# EAGLE design headstage (EAGLE 7.2.0)
HEADSTAGE_TYPE: JMD Dual RHD2132; REVISION: 0.0
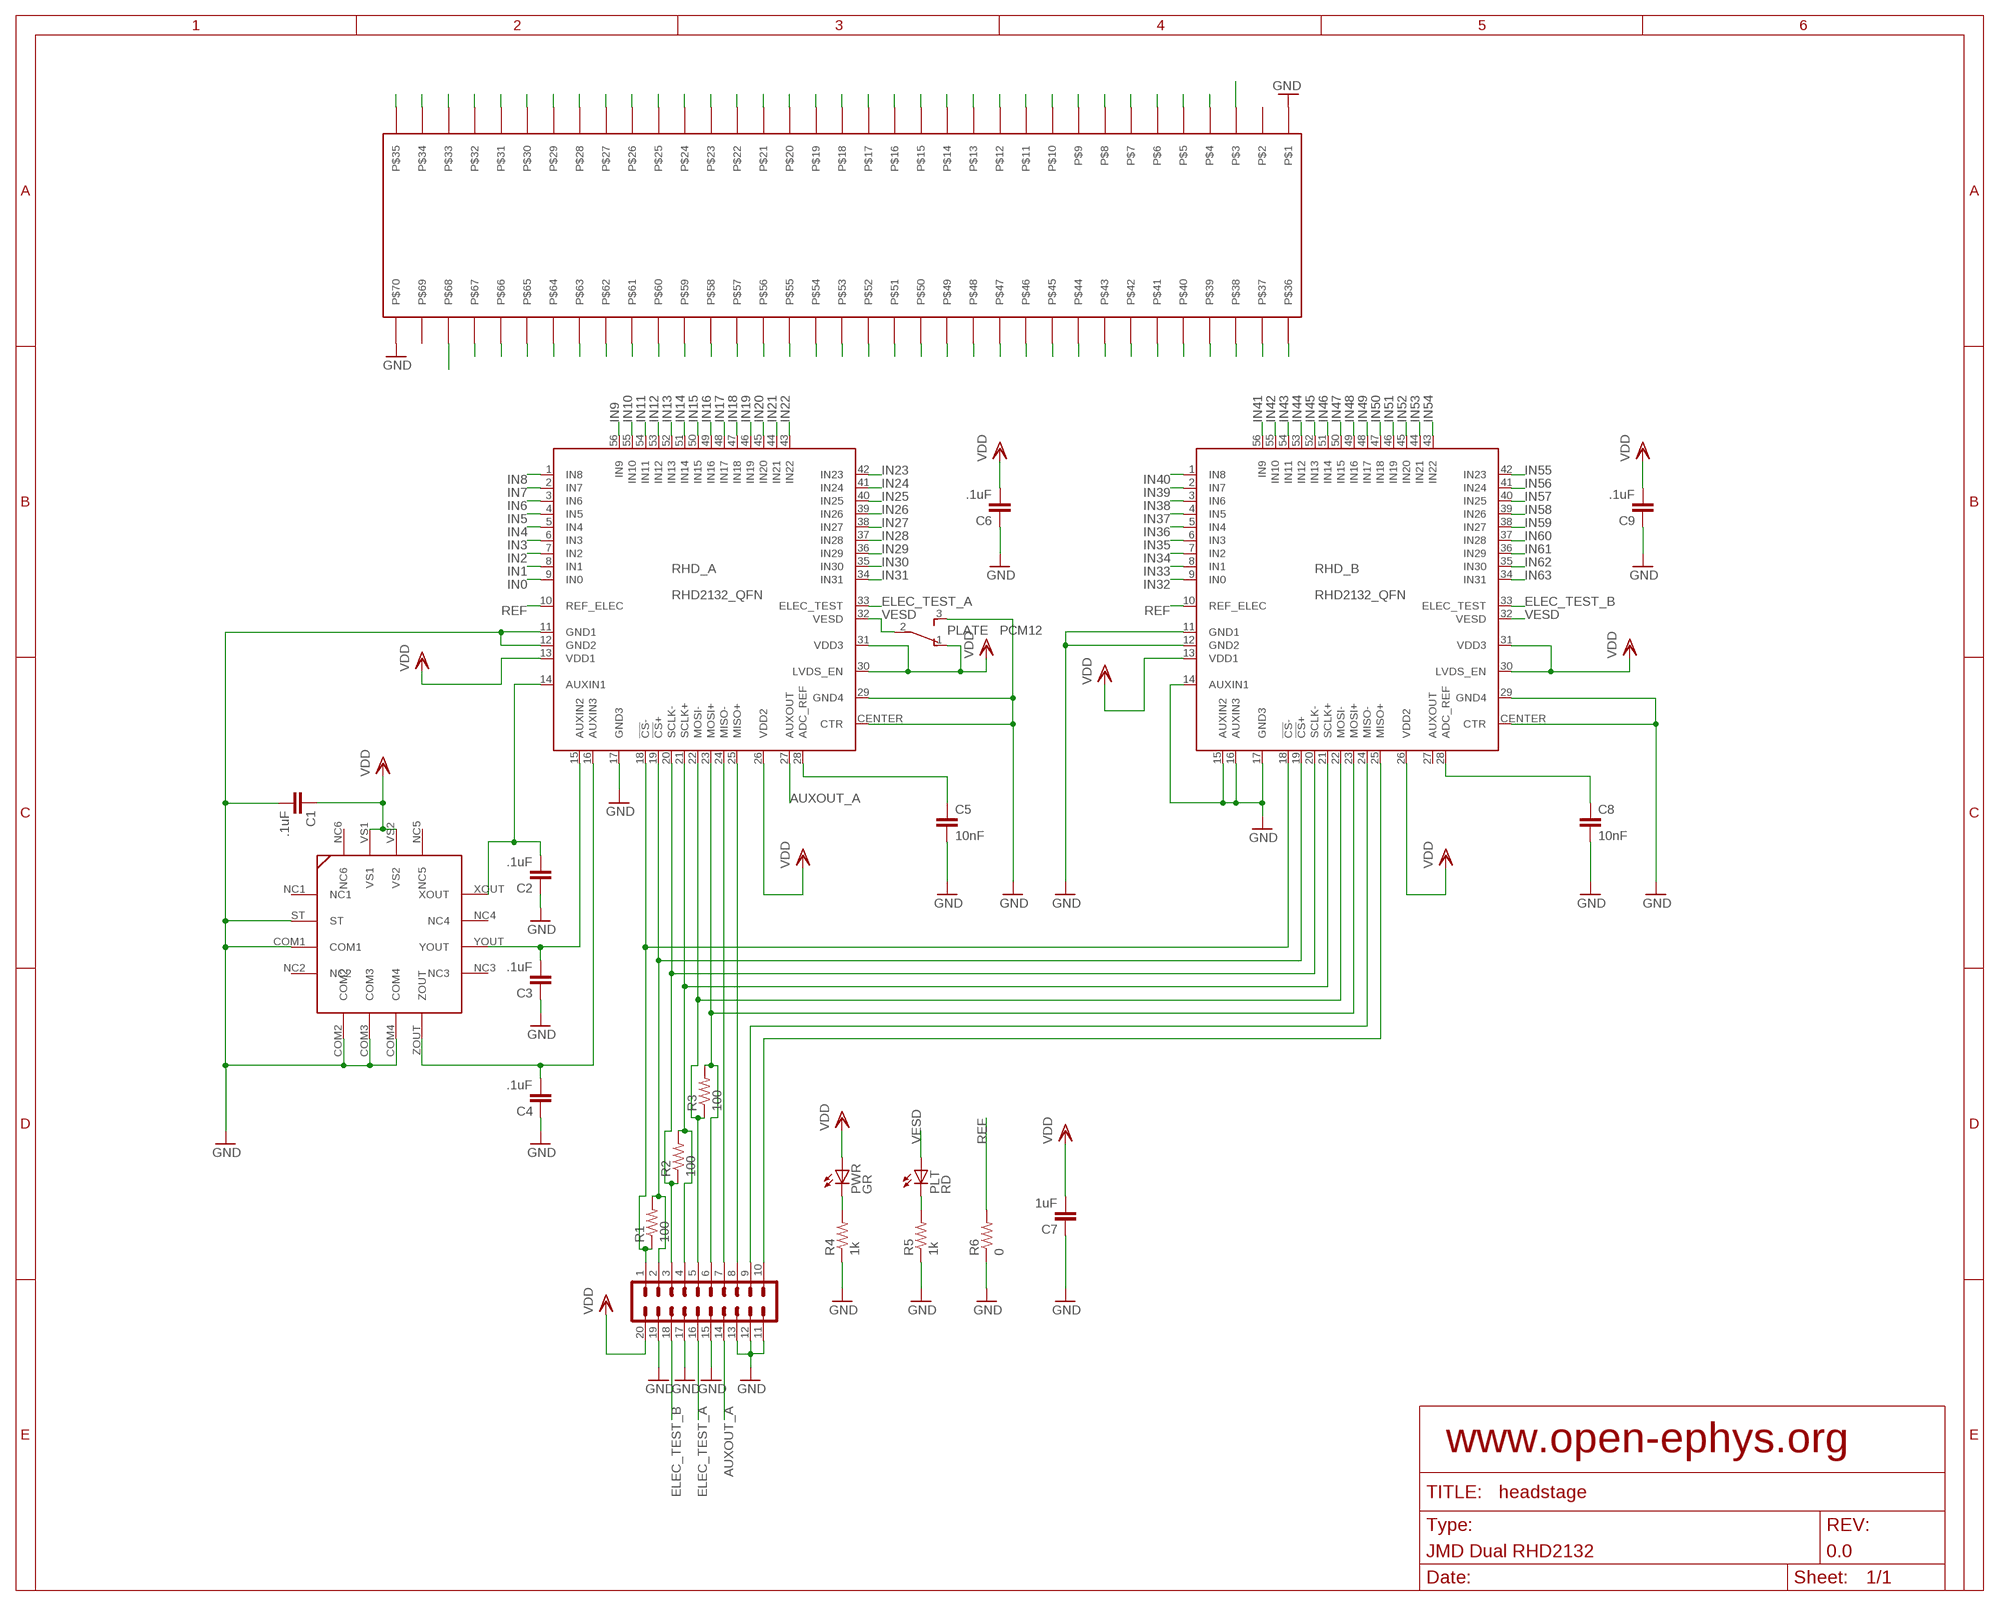
[diagram p0: schematic, sheet 1]

## Parts
C1  .1uF  C_0402  [0402]
C2  .1uF  C_0402  [0402]
C3  .1uF  C_0402  [0402]
C4  .1uF  C_0402  [0402]
C5  10nF  C_0402  [0402]
C6  .1uF  C_0603  [0603]
C7  1uF  C_0603  [0603]
C8  10nF  C_0402  [0402]
C9  .1uF  C_0603  [0603]
OUT  JMD  PINHD-2X10_JMD-RA  [JMD20-RA]
PLATE  PCM12  SPDT_PCM12  [PCM12]
PLT  RD  LED_0603  [CHIP-LED0603]
PWR  GR  LED_0603  [CHIP-LED0603]
R1  100  R_0402  [0402]
R2  100  R_0402  [0402]
R3  100  R_0402  [0402]
R4  1k  R_0402  [0402]
R5  1k  R_0402  [0402]
R6  0  R_0402  [0402]
RHD_A  RHD2132_QFN  [QFN56_8_X_8_LARGE]
RHD_B  RHD2132_QFN  [QFN56_8_X_8_LARGE]
U1  ADXL335  [ADXL335]
U$1  HIROSE_DF40_70PIN  [HIROSE_DF40C-70DS]

## Nets
AUXOUT_A: OUT.14 RHD_A.27(AUXOUT)
CS+: OUT.2 R1.2 RHD_A.19(!CS!+) RHD_B.19(!CS!+)
CS-: OUT.1 R1.1 RHD_A.18(!CS!-) RHD_B.18(!CS!-)
ELEC_TEST_A: OUT.16 RHD_A.33(ELEC_TEST)
ELEC_TEST_B: OUT.18 RHD_B.33(ELEC_TEST)
GND: C1.2 C2.1 C3.1 C4.1 C5.2 C6.1 C7.1 C8.2 C9.1 OUT.11 OUT.12 OUT.13 OUT.15 OUT.17 OUT.19 PLATE.3 R4.1 R5.1 R6.1 RHD_A.11(GND1) RHD_A.12(GND2) RHD_A.17(GND3) RHD_A.29(GND4) RHD_A.CENTER(CTR) RHD_B.11(GND1) RHD_B.12(GND2) RHD_B.14(AUXIN1) RHD_B.15(AUXIN2) RHD_B.16(AUXIN3) RHD_B.17(GND3) RHD_B.29(GND4) RHD_B.CENTER(CTR) U1.COM1 U1.COM2 U1.COM3 U1.COM4 U1.ST U$1.P$1 U$1.P$70
IN0: RHD_A.9(IN0) U$1.P$4
IN1: RHD_A.8(IN1) U$1.P$5
IN2: RHD_A.7(IN2) U$1.P$6
IN3: RHD_A.6(IN3) U$1.P$7
IN4: RHD_A.5(IN4) U$1.P$8
IN5: RHD_A.4(IN5) U$1.P$9
IN6: RHD_A.3(IN6) U$1.P$10
IN7: RHD_A.2(IN7) U$1.P$11
IN8: RHD_A.1(IN8) U$1.P$12
IN9: RHD_A.56(IN9) U$1.P$13
IN10: RHD_A.55(IN10) U$1.P$14
IN11: RHD_A.54(IN11) U$1.P$15
IN12: RHD_A.53(IN12) U$1.P$16
IN13: RHD_A.52(IN13) U$1.P$17
IN14: RHD_A.51(IN14) U$1.P$18
IN15: RHD_A.50(IN15) U$1.P$19
IN16: RHD_A.49(IN16) U$1.P$20
IN17: RHD_A.48(IN17) U$1.P$21
IN18: RHD_A.47(IN18) U$1.P$22
IN19: RHD_A.46(IN19) U$1.P$23
IN20: RHD_A.45(IN20) U$1.P$24
IN21: RHD_A.44(IN21) U$1.P$25
IN22: RHD_A.43(IN22) U$1.P$26
IN23: RHD_A.42(IN23) U$1.P$27
IN24: RHD_A.41(IN24) U$1.P$28
IN25: RHD_A.40(IN25) U$1.P$29
IN26: RHD_A.39(IN26) U$1.P$30
IN27: RHD_A.38(IN27) U$1.P$31
IN28: RHD_A.37(IN28) U$1.P$32
IN29: RHD_A.36(IN29) U$1.P$33
IN30: RHD_A.35(IN30) U$1.P$34
IN31: RHD_A.34(IN31) U$1.P$35
IN32: RHD_B.9(IN0) U$1.P$67
IN33: RHD_B.8(IN1) U$1.P$66
IN34: RHD_B.7(IN2) U$1.P$65
IN35: RHD_B.6(IN3) U$1.P$64
IN36: RHD_B.5(IN4) U$1.P$63
IN37: RHD_B.4(IN5) U$1.P$62
IN38: RHD_B.3(IN6) U$1.P$61
IN39: RHD_B.2(IN7) U$1.P$60
IN40: RHD_B.1(IN8) U$1.P$59
IN41: RHD_B.56(IN9) U$1.P$58
IN42: RHD_B.55(IN10) U$1.P$57
IN43: RHD_B.54(IN11) U$1.P$56
IN44: RHD_B.53(IN12) U$1.P$55
IN45: RHD_B.52(IN13) U$1.P$54
IN46: RHD_B.51(IN14) U$1.P$53
IN47: RHD_B.50(IN15) U$1.P$52
IN48: RHD_B.49(IN16) U$1.P$51
IN49: RHD_B.48(IN17) U$1.P$50
IN50: RHD_B.47(IN18) U$1.P$49
IN51: RHD_B.46(IN19) U$1.P$48
IN52: RHD_B.45(IN20) U$1.P$47
IN53: RHD_B.44(IN21) U$1.P$46
IN54: RHD_B.43(IN22) U$1.P$45
IN55: RHD_B.42(IN23) U$1.P$44
IN56: RHD_B.41(IN24) U$1.P$43
IN57: RHD_B.40(IN25) U$1.P$42
IN58: RHD_B.39(IN26) U$1.P$41
IN59: RHD_B.38(IN27) U$1.P$40
IN60: RHD_B.37(IN28) U$1.P$39
IN61: RHD_B.36(IN29) U$1.P$38
IN62: RHD_B.35(IN30) U$1.P$37
IN63: RHD_B.34(IN31) U$1.P$36
LEDOUT1: PWR.C R4.2
LEDOUT2: PLT.C R5.2
MIS02-: OUT.9 RHD_B.24(MISO-)
MISO1+: OUT.8 RHD_A.25(MISO+)
MISO1-: OUT.7 RHD_A.24(MISO-)
MISO2+: OUT.10 RHD_B.25(MISO+)
MOSI+: OUT.6 R3.2 RHD_A.23(MOSI+) RHD_B.23(MOSI+)
MOSI-: OUT.5 R3.1 RHD_A.22(MOSI-) RHD_B.22(MOSI-)
N$3: C8.1 RHD_B.28(ADC_REF)
N$7: C5.1 RHD_A.28(ADC_REF)
REF: R6.2 RHD_A.10(REF_ELEC) RHD_B.10(REF_ELEC) U$1.P$3 U$1.P$68
SCLK+: OUT.4 R2.2 RHD_A.21(SCLK+) RHD_B.21(SCLK+)
SCLK-: OUT.3 R2.1 RHD_A.20(SCLK-) RHD_B.20(SCLK-)
VDD: C1.1 C6.2 C7.2 C9.2 OUT.20 PLATE.1 PWR.A RHD_A.13(VDD1) RHD_A.26(VDD2) RHD_A.30(LVDS_EN) RHD_A.31(VDD3) RHD_B.13(VDD1) RHD_B.26(VDD2) RHD_B.30(LVDS_EN) RHD_B.31(VDD3) U1.VS1 U1.VS2
VESD: PLATE.2 PLT.A RHD_A.32(VESD) RHD_B.32(VESD)
XOUT1: C2.2 RHD_A.14(AUXIN1) U1.XOUT
YOUT1: C3.2 RHD_A.15(AUXIN2) U1.YOUT
ZOUT1: C4.2 RHD_A.16(AUXIN3) U1.ZOUT
Unconnected: RHD_B.27(AUXOUT) U1.NC1 U1.NC2 U1.NC3 U1.NC4 U1.NC5 U1.NC6 U$1.P$2 U$1.P$69

## Library data of the parts
C1-C9 = headstage:C: Capacitor
OUT = headstage:PINHD-2X10
PLATE = headstage:SPDT: SPDT Switch
PLT PWR = puggleboard:LED
R1-R6 = headstage:R: Resistor
RHD_A RHD_B = headstage:RHD2132
U1 = headstage:ADXL335: The ADXL335 is a small, thin, low power, complete 3-axis accelerometer with signal conditioned voltage outputs. The product measures acceleration with a minimum full-scale range of ±3 g. It can measure the static acceleration of gravity in tilt-sensing applications, as well as dynamic acceleration resulting from motion, shock, or vibration. The user selects the bandwidth of the accelerometer using the CX, CY, and CZ capacitors at the XOUT, YOUT, and ZOUT pins. Bandwidths can be selected to suit the application, with a range of 0.5 Hz to 1600 Hz for the X and Y axes, and a range of 0.5 Hz to 550 Hz for the Z axi
U$1 = GG_hirose70:HIROSE_DF40_70PIN

## Board
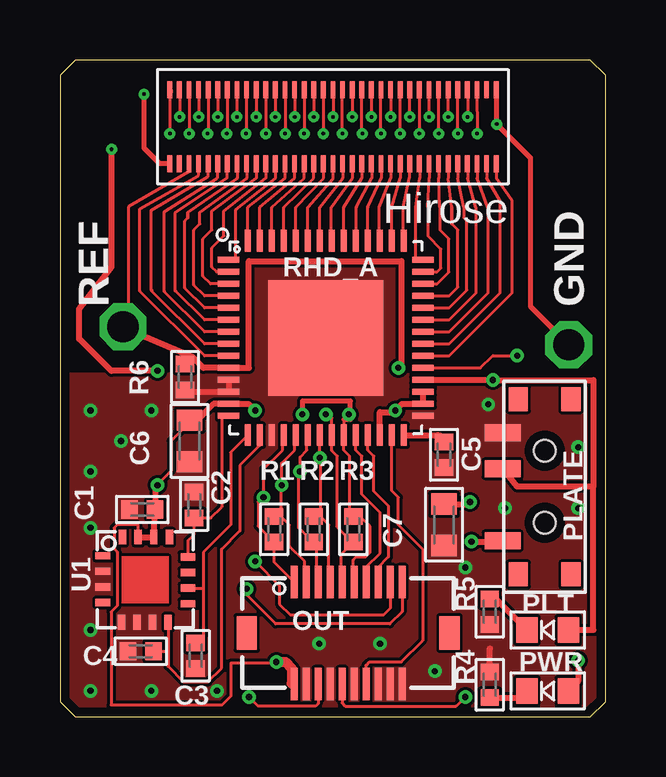
[diagram p1: board, top side]
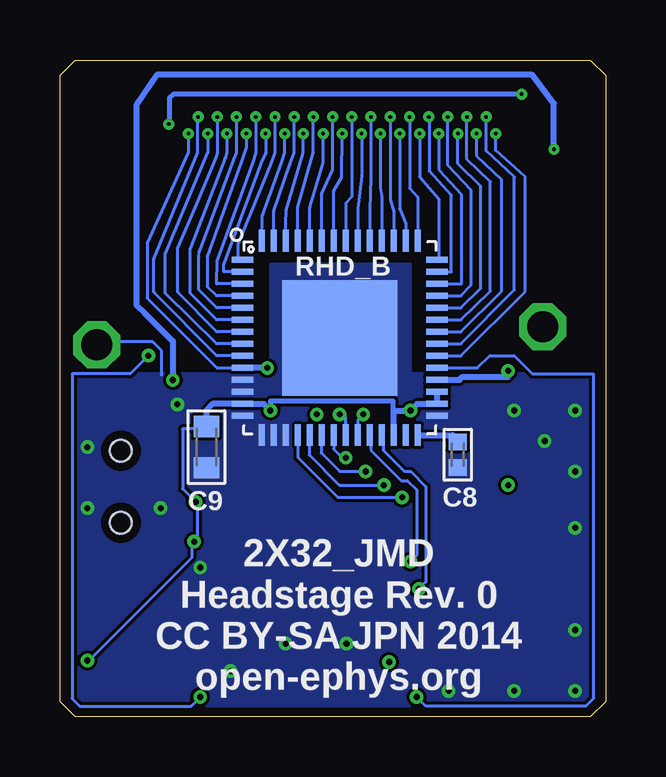
[diagram p2: board, bottom side, seen from below]

Size 22.73 x 27.37 mm. Coordinates in mm from the lower left corner, seen from the top.
Outline: 0.64,0 22.1,0 22.73,0.64 22.73,26.73 22.1,27.37 0.64,27.37 0,26.73 0,0.64 0.64,0
Copper layers (1+2*15+16): Top 0.0356mm / dielectric 1.5011mm / Route2 0.0356mm / dielectric 0.1499mm / Route15 0.0356mm / dielectric 0.2007mm / Bottom 0.0356mm
Design rules "ohs-park-4-layer *": minimum track width 5mil, minimum drill 10mil, track to track 5mil, track to pad 5mil, pad to pad 5mil, via to via 5mil, smd to smd 5mil, copper to edge 15mil, drill to drill 5mil, minimum pad ring 6mil, minimum via ring 6mil, stop-mask expansion 4mil, vias tented up to drill 100mil, thermal gap 10mil

### Footprints (pad centres in the part's own frame; a part is rotated, then mirrored left to right if it is on the bottom)
0402 = smd 0.686 x 0.762: 1 -0.533,0; 2 0.533,0
0603 = smd 0.889 x 1.067: 1 -0.864,0; 2 0.864,0
JMD20-RA = smd 0.3 x 1.35: 1 -4.5,2.125; 2 -4,2.125; 3 -3.5,2.125; 4 -3,2.125; 5 -2.5,2.125; 6 -2,2.125; 7 -1.5,2.125; 8 -1,2.125; 9 -0.5,2.125; 10 0,2.125; 11 0,-2.125; 12 -0.5,-2.125; 13 -1,-2.125; 14 -1.5,-2.125; 15 -2,-2.125; 16 -2.5,-2.125; 17 -3,-2.125; 18 -3.5,-2.125; 19 -4,-2.125; 20 -4.5,-2.125 | smd 0.85 x 1.4: MECH1 -6.475,0; MECH2 1.975,0
PCM12 = smd 0.7 x 1.5: 1 -2.25,1.75; 2 0.75,1.75; 3 2.25,1.75 | smd 1 x 0.8: NC1 -3.65,1.1; NC2 -3.65,-1.1; NC3 3.65,-1.1; NC4 3.65,1.1 | hole 0.9: 1.5,0; -1.5,0
CHIP-LED0603 = smd 1.067 x 0.889: A 0,-0.864; C 0,0.864
QFN56_8_X_8_LARGE = smd 0.9 x 0.25: 1 -4.05,3.25; 2 -4.05,2.75; 3 -4.05,2.25; 4 -4.05,1.75; 5 -4.05,1.25; 6 -4.05,0.75; 7 -4.05,0.25; 8 -4.05,-0.25; 9 -4.05,-0.75; 10 -4.05,-1.25; 11 -4.05,-1.75; 12 -4.05,-2.25; 13 -4.05,-2.75; 14 -4.05,-3.25; 29 4.05,-3.25; 30 4.05,-2.75; 31 4.05,-2.25; 32 4.05,-1.75; 33 4.05,-1.25; 34 4.05,-0.75; 35 4.05,-0.25; 36 4.05,0.25; 37 4.05,0.75; 38 4.05,1.25; 39 4.05,1.75; 40 4.05,2.25; 41 4.05,2.75; 42 4.05,3.25 | smd 0.25 x 0.9: 15 -3.25,-4.05; 16 -2.75,-4.05; 17 -2.25,-4.05; 18 -1.75,-4.05; 19 -1.25,-4.05; 20 -0.75,-4.05; 21 -0.25,-4.05; 22 0.25,-4.05; 23 0.75,-4.05; 24 1.25,-4.05; 25 1.75,-4.05; 26 2.25,-4.05; 27 2.75,-4.05; 28 3.25,-4.05; 43 3.25,4.05; 44 2.75,4.05; 45 2.25,4.05; 46 1.75,4.05; 47 1.25,4.05; 48 0.75,4.05; 49 0.25,4.05; 50 -0.25,4.05; 51 -0.75,4.05; 52 -1.25,4.05; 53 -1.75,4.05; 54 -2.25,4.05; 55 -2.75,4.05; 56 -3.25,4.05 | smd 4.8 x 4.8: CENTER 0,0
ADXL335 = smd 0.61 x 0.305: COM1 -1.775,-0.3; NC1 -1.775,1; NC2 -1.775,-0.95; NC3 1.775,-1; NC4 1.775,0.3; ST -1.775,0.35; XOUT 1.775,0.95; YOUT 1.775,-0.35 | smd 0.305 x 0.61: COM2 -1,-1.775; COM3 -0.35,-1.775; COM4 0.3,-1.775; NC5 1,1.775; NC6 -0.95,1.775; VS1 0.35,1.775; VS2 -0.3,1.775; ZOUT 0.95,-1.775
HIROSE_DF40C-70DS = smd 0.2 x 0.7: P$1 0,0; P$2 -0.4,0; P$3 -0.8,0; P$4 -1.2,0; P$5 -1.6,0; P$6 -2,0; P$7 -2.4,0; P$8 -2.8,0; P$9 -3.2,0; P$10 -3.6,0; P$11 -4,0; P$12 -4.4,0; P$13 -4.8,0; P$14 -5.2,0; P$15 -5.6,0; P$16 -6,0; P$17 -6.4,0; P$18 -6.8,0; P$19 -7.2,0; P$20 -7.6,0; P$21 -8,0; P$22 -8.4,0; P$23 -8.8,0; P$24 -9.2,0; P$25 -9.6,0; P$26 -10,0; P$27 -10.4,0; P$28 -10.8,0; P$29 -11.2,0; P$30 -11.6,0; P$31 -12,0; P$32 -12.4,0; P$33 -12.8,0; P$34 -13.2,0; P$35 -13.6,0; P$36 0,-3.08; P$37 -0.4,-3.08; P$38 -0.8,-3.08; P$39 -1.2,-3.08; P$40 -1.6,-3.08; P$41 -2,-3.08; P$42 -2.4,-3.08; P$43 -2.8,-3.08; P$44 -3.2,-3.08; P$45 -3.6,-3.08; P$46 -4,-3.08; P$47 -4.4,-3.08; P$48 -4.8,-3.08; P$49 -5.2,-3.08; P$50 -5.6,-3.08; P$51 -6,-3.08; P$52 -6.4,-3.08; P$53 -6.8,-3.08; P$54 -7.2,-3.08; P$55 -7.6,-3.08; P$56 -8,-3.08; P$57 -8.4,-3.08; P$58 -8.8,-3.08; P$59 -9.2,-3.08; P$60 -9.6,-3.08; P$61 -10,-3.08; P$62 -10.4,-3.08; P$63 -10.8,-3.08; P$64 -11.2,-3.08; P$65 -11.6,-3.08; P$66 -12,-3.08; P$67 -12.4,-3.08; P$68 -12.8,-3.08; P$69 -13.2,-3.08; P$70 -13.6,-3.08

### Placement (x,y rotation side)
C1  3.43,8.64 180 top
C2  5.59,8.83 270 top
C3  5.65,2.54 90 top
C4  3.37,2.73 0 top
C5  16,10.92 270 top
C6  5.4,11.49 90 top
C7  16,8 90 top
C8  6.16,10.92 270 bottom
C9  16.64,11.24 90 bottom
OUT  14.26,3.49 0 top
PLATE  20.19,9.59 90 top
PLT  20.32,3.62 90 top
PWR  20.32,1.08 90 top
R1  8.92,7.81 90 top
R2  10.57,7.81 90 top
R3  12.22,7.81 90 top
R4  17.91,1.33 270 top
R5  17.91,4.38 90 top
R6  5.21,14.16 90 top
RHD_A  11.07,15.79 0 top
RHD_B  11.07,15.79 0 bottom
U1  3.56,5.71 0 top
U$1  4.57,23.05 180 top

### Tracks (layer width: path | path; a pad name or v marks a point on that pad's centre or on a via)
AUXOUT_A
  Top 0.127: RHD_A.27 13.82,9.42 14.1,9.14 14.1,8 15.11,6.99 15.11,3.17 14.22,2.29 12.89,2.29 12.76,2.15 OUT.14
  Top 0.152: RHD_A.27 13.84,11.72
CS+  (via drill 0.25)
  Top 0.127: 10.19,5.55 10.19,6.48 9.56,7.11 9.56,8 9.21,8.34 9.21,9.63 v9.24,9.65 9.24,10.57 9.78,11.11 9.78,11.74
  Top 0.152: OUT.2 10.19,5.55 | 9.21,8.34 R1.2 | 9.78,11.74 RHD_A.19
  Bottom 0.127: 12.36,11.7 12.36,10.91 11.09,9.65 v9.24,9.65
  Bottom 0.152: RHD_B.19 12.36,11.7
CS-  (via drill 0.25)
  Top 0.127: OUT.1 8.92,6.45 R1.1 8.26,7.94 8.26,8.95 8.45,9.14 v8.48,9.14 8.48,10.32 9.27,11.11 9.27,11.74 RHD_A.18
  Bottom 0.127: RHD_B.18 12.82,10.81 11.16,9.14 v8.48,9.14
ELEC_TEST_A  (via drill 0.25)
  Top 0.127: RHD_A.33 17.52,14.54 18.03,15.05 v19.05,15.05 | v16.89,0.83 16.51,0.45 11.89,0.45 11.76,0.58 OUT.16
  Bottom 0.127: v19.05,15.05 19.81,14.29 22.23,14.29 22.23,0.76 21.91,0.45 17.27,0.45 v16.89,0.83
ELEC_TEST_B  (via drill 0.25)
  Top 0.127: v7.87,0.83 8.26,0.45 10.65,0.45 10.76,0.55 OUT.18
  Bottom 0.127: RHD_B.33 5.34,14.54 4.83,15.05 3.81,15.05 3.05,14.29 0.51,14.29 0.51,0.76 0.83,0.45 7.49,0.45 v7.87,0.83
GND  (via drill 0.15, 0.25, 1.3)
  Top 0.2: U$1.P$70 18.17,24.73 v18.2,24.7 19.6,23.3 19.6,17.1 v21.2,15.5 | U$1.P$1 4.15,23.05 3.5,23.7 v3.5,25.95
  Top 0.254: 5.05,13.53 R6.1 5.3,13.54 RHD_A.12 RHD_A.11 | R4.1 17.91,2.86
  Bottom 0.127: 18.17,24.73 v18.2,24.7 18.25,24.65 | 18.5,14.25 18.5,15.25 18.88,15.62 21,15.62 21.12,15.5 v21.2,15.5
  Bottom 0.2: v3.5,25.95 17.99,25.95 18.17,25.78 18.17,24.73
  other vias: 1.27,10.22 1.27,12.76 1.27,3.62 1.27,7.87 6.54,1.08 3.81,1.08 1.27,1.08 21.59,8.7 21.59,11.24 15.62,1.91 3.81,12.76 18.54,8.7 16.89,6.22 13.34,3.05 10.79,3.05 2.54,11.49 17.84,13.02
  pour Top (no thermals): 0,0 0,14.29 8.13,14.29 8.13,18.86 13.97,18.86 13.97,14.29 22.73,14.29 22.73,0
  pour Bottom (no thermals): 0,0 0,14.29 8.13,14.29 8.13,18.86 13.97,18.86 13.97,14.29 22.73,14.29 22.73,0
IN0
  Top 0.127: RHD_A.9 6.03,15.04 3.33,17.74 3.33,21.17 5.75,22.55 5.77,22.57 U$1.P$4
IN1
  Top 0.127: RHD_A.8 6.03,15.54 3.83,17.74 | 3.83,17.78 3.83,17.74 | 3.83,17.74 3.83,17.78 | 3.83,17.78 | 3.83,17.78 3.8,17.78 3.8,21.1 6.15,22.5 6.17,22.52 U$1.P$5
IN2
  Top 0.127: RHD_A.7 6.03,16.04 4.33,17.74 | 4.33,17.74 | U$1.P$6 6.55,23.05 6.55,22.45 4.35,21.05 4.35,17.74 4.33,17.74
IN3
  Top 0.127: RHD_A.6 6.03,16.54 4.83,17.74 4.8,17.74 4.8,21 6.95,22.45 6.95,23.05 U$1.P$7
IN4
  Top 0.127: 5.33,20.79 5.2,20.66 5.2,17.86 6.03,17.04 RHD_A.5 | 5.33,21.02 5.33,20.79 | 5.33,20.79 5.33,21.02 | U$1.P$8 7.38,22.45 5.33,21.02
IN5
  Top 0.127: RHD_A.4 6.03,17.54 5.58,17.99 5.58,20.29 5.83,20.54 5.83,21.02 7.78,22.45 U$1.P$9
IN6
  Top 0.127: RHD_A.3 6.28,18.04 5.95,18.36 5.95,19.91 6.33,20.29 6.33,21.07 8.18,22.45 U$1.P$10
IN7
  Top 0.127: RHD_A.2 6.53,18.54 6.33,18.74 6.33,19.54 6.83,20.04 6.83,21.07 8.58,22.45 U$1.P$11
IN8
  Top 0.127: 7.33,19.04 7.33,21.12 8.98,22.45 8.98,23.03 arc-90 U$1.P$12
  Top 0.152: 7.33,19.04 RHD_A.1 7.33,19.04
IN9
  Top 0.127: RHD_A.56 7.83,21.23 9.38,22.45 9.38,23.03 arc-90 U$1.P$13
  Top 0.152: RHD_A.56
IN10
  Top 0.127: RHD_A.55 8.32,21.23 9.78,22.45 9.78,23.03 arc-90 U$1.P$14
  Top 0.152: RHD_A.55
IN11
  Top 0.127: RHD_A.54 8.82,21.23 10.17,22.45 10.17,23.02 arc90 U$1.P$15
  Top 0.152: RHD_A.54
IN12
  Top 0.127: RHD_A.53 9.32,21.23 10.57,22.45 10.57,23.03 arc-90 U$1.P$16
  Top 0.152: RHD_A.53
IN13
  Top 0.127: RHD_A.52 9.82,21.23 10.98,22.45 10.98,23.13 arc-90 U$1.P$17
  Top 0.152: RHD_A.52
IN14
  Top 0.127: RHD_A.51 10.32,21.23 11.38,22.45 11.38,23.02 arc90 U$1.P$18
  Top 0.152: RHD_A.51
IN15
  Top 0.127: RHD_A.50 10.82,21.23 11.78,22.45 U$1.P$19
IN16
  Top 0.127: U$1.P$20 12.18,22.45 11.3,21.23 11.3,19.84 RHD_A.49
  Top 0.152: RHD_A.49
IN17
  Top 0.127: RHD_A.48 11.82,21.23 12.58,22.45 U$1.P$21
IN18
  Top 0.127: U$1.P$22 12.98,22.45 12.35,21.23 12.35,19.84 RHD_A.47
  Top 0.152: RHD_A.47
IN19
  Top 0.127: RHD_A.46 12.82,21.23 13.38,22.45 U$1.P$23
IN20
  Top 0.127: RHD_A.45 13.3,19.84 13.3,21.23 13.78,22.45 U$1.P$24
  Top 0.152: RHD_A.45
IN21
  Top 0.127: RHD_A.44 13.82,21.23 14.18,22.45 U$1.P$25
IN22
  Top 0.127: RHD_A.43 14.3,19.84 14.3,21.23 14.55,22.45 14.55,23.05 U$1.P$26
  Top 0.152: RHD_A.43
IN23
  Top 0.127: 14.82,19.04 14.82,21.23 14.98,22.45 U$1.P$27
  Top 0.152: 14.82,19.04 RHD_A.42
IN24
  Top 0.127: RHD_A.41 15.71,18.54 15.87,18.7 15.87,19.49 15.32,20.04 15.32,21.23 15.38,22.45 U$1.P$28
IN25
  Top 0.127: RHD_A.40 15.71,18.04 16.2,18.53 16.2,19.91 15.82,20.29 15.82,21.23 15.78,22.45 U$1.P$29
IN26
  Top 0.127: 16.32,20.54 16.57,20.29 16.57,17.9 16.21,17.54 RHD_A.39 | U$1.P$30 16.18,22.45 16.32,21.23
  Top 0.152: 16.32,21.23 16.32,20.54
IN27
  Top 0.127: RHD_A.38 16.21,17.04 16.95,17.78 16.95,20.66 16.82,20.79 16.82,21.23 16.58,22.45 U$1.P$31
IN28
  Top 0.127: RHD_A.37 16.21,16.54 17.32,17.65 17.32,21.23 16.98,22.45 U$1.P$32
IN29
  Top 0.127: RHD_A.36 16.21,16.04 17.82,17.65 17.82,21.23 17.38,22.45 U$1.P$33
IN30
  Top 0.127: RHD_A.35 16.21,15.54 18.32,17.65 18.32,21.52 17.78,22.45 U$1.P$34
IN31
  Top 0.127: RHD_A.34 16.21,15.04 18.82,17.65 18.82,21.52 18.18,22.45 U$1.P$35
IN32  (via drill 0.15)
  Top 0.127: v16.98,25 16.98,26.07 17,26.12 U$1.P$67
  Bottom 0.127: v16.98,25 17,25 17,23.5 18.82,19.06 18.82,17.7 16.21,15.04 RHD_B.9
IN33  (via drill 0.15)
  Top 0.127: v16.58,24.3 16.58,26 | 16.58,26 16.58,26.06 | U$1.P$66 16.62,26.12 16.62,26 16.58,26
  Bottom 0.127: v16.58,24.3 16.58,23.5 18.35,19.28 18.35,17.65 16.21,15.54 RHD_B.8
IN34  (via drill 0.15)
  Top 0.127: v16.18,25 16.18,26 | 16.18,26 16.18,26.09 | U$1.P$65 16.12,26.12 16.12,26 16.18,26
  Bottom 0.127: v16.18,25 16.18,23.5 16.25,23.3 17.05,21.35 17.82,19.57 17.82,17.7 16.21,16.04 RHD_B.7
IN35  (via drill 0.15)
  Top 0.127: v15.78,24.3 15.8,24.31 15.78,24.35 | v15.78,24.3 15.78,24.35 | 15.78,24.35 U$1.P$64 15.75,26.12 U$1.P$64
  Bottom 0.127: v15.78,24.3 15.78,23.5 15.85,23.3 17.3,19.53 17.3,17.65 16.21,16.54 RHD_B.6
IN36  (via drill 0.15)
  Top 0.127: v15.38,25 15.38,26.09 U$1.P$63
  Bottom 0.127: v15.38,25 15.38,23.5 15.5,23.25 16.93,19.4 16.95,19.15 16.95,17.8 16.21,17.04 RHD_B.5
IN37  (via drill 0.15)
  Top 0.127: U$1.P$62 | U$1.P$62 v14.97,24.3 | U$1.P$62 15,26.12 U$1.P$62
  Bottom 0.127: v14.97,24.3 14.97,23.73 15.1,23.35 16.6,19.2 16.6,17.93 16.21,17.54 RHD_B.4
IN38  (via drill 0.15)
  Top 0.127: v14.57,25 14.57,26.01 | 14.57,26.01 14.57,26.05 | U$1.P$61 14.62,26.12 14.62,26 14.57,26.01
  Bottom 0.127: v14.57,25 14.57,23.5 14.7,23.1 16.18,19.05 16.21,18.04 RHD_B.3
IN39  (via drill 0.15)
  Top 0.127: v14.17,24.3 14.17,26.09 14.12,26.12 U$1.P$60
  Bottom 0.127: v14.17,24.3 14.17,23.5 14.35,23.1 15.9,18.89 15.9,18.54 RHD_B.2
IN40  (via drill 0.15)
  Top 0.127: 13.78,25.05 v13.78,25 13.78,26.1 13.75,26.12 U$1.P$59
  Bottom 0.127: v13.78,25 13.78,23.5 13.95,23.05 15.32,19.69 15.32,19.04 RHD_B.1
IN41  (via drill 0.15)
  Top 0.127: v13.37,24.3 13.37,26 | 13.37,26 13.37,26.04 | U$1.P$58 13.38,26 13.37,26
  Bottom 0.127: RHD_B.56 14.3,20.86 13.5,23.1 13.37,23.5 v13.37,24.3
IN42  (via drill 0.15)
  Top 0.127: v12.97,25 12.97,26.1 13,26.12 U$1.P$57
  Bottom 0.127: RHD_B.55 13.82,21.06 13.15,23 12.97,23.5 v12.97,25
IN43  (via drill 0.15)
  Top 0.127: v12.6,24.3 12.58,24.41 12.58,26.09 12.62,26.12 U$1.P$56
  Bottom 0.127: RHD_B.54 13.32,20.54 13.3,21.11 12.6,23.5 v12.6,24.3
IN44  (via drill 0.15)
  Top 0.127: 12.18,26.05 12.18,26.01 | 12.18,26.01 12.18,25.2 v12.18,25 | U$1.P$55 12.12,26.12 12.12,26 12.18,26.01
  Bottom 0.127: RHD_B.53 12.82,21.23 12.18,23.5 v12.18,25
IN45  (via drill 0.15)
  Top 0.127: v11.77,24.3 11.77,26.09 11.75,26.12 U$1.P$54
  Bottom 0.127: RHD_B.52 12.32,21.21 11.77,23.09 v11.77,24.3
IN46  (via drill 0.15)
  Top 0.127: v11.38,25 U$1.P$53
  Bottom 0.127: RHD_B.51 11.82,21.79 11.38,22.79 v11.38,25
IN47  (via drill 0.15)
  Top 0.127: 10.97,26.02 10.97,26 | 10.97,26 v10.97,24.3 | U$1.P$52 11,26.12 11,26 10.97,26
  Bottom 0.127: RHD_B.50 11.32,21.91 11,22.48 v10.97,24.3
IN48  (via drill 0.15)
  Top 0.127: v10.57,25 10.57,26.01 10.62,26 10.62,26.12 U$1.P$51
  Bottom 0.127: v10.57,25 10.57,21.68 10.82,21.4 RHD_B.49
IN49  (via drill 0.15)
  Top 0.127: v10.17,24.3 10.17,25.97 10.12,26 10.12,26.12 U$1.P$50
  Bottom 0.127: v10.17,24.3 10.17,22.54 10.32,21.16 RHD_B.48
IN50  (via drill 0.15 pad 0.25)
  Top 0.127: v9.78,25 9.77,25.03 9.78,25.15 9.78,25.96 9.75,26 9.75,26.12 U$1.P$49
  Bottom 0.127: v9.78,25 9.78,22.47 9.82,21.14 RHD_B.47
IN51  (via drill 0.15)
  Top 0.127: v9.38,24.3 9.38,25.96 9.38,26 U$1.P$48
  Bottom 0.127: v9.38,24.3 9.38,22.04 9.32,21.66 RHD_B.46
IN52  (via drill 0.15)
  Top 0.127: v8.97,25 8.97,25.15 8.97,26 | 8.97,26.02 8.97,26 | U$1.P$47 9,26.12 9,26 8.97,26
  Bottom 0.127: v8.97,25 8.97,21.54 8.82,21.04 RHD_B.45
IN53  (via drill 0.15)
  Top 0.127: v8.58,24.3 8.58,26.09 8.62,26.12 U$1.P$46
  Bottom 0.127: v8.58,24.3 8.58,21.16 8.32,20.54 RHD_B.44
IN54  (via drill 0.15)
  Top 0.127: v8.17,25 8.18,25.15 8.17,25.25 8.17,26 | 8.17,26.02 8.17,26 | U$1.P$45 8.12,26.12 8.12,26 8.17,26
  Bottom 0.127: v8.17,25 8.17,22.02 7.83,21.65 RHD_B.43
IN55  (via drill 0.15)
  Top 0.127: v7.75,24.3 v7.75,24.31 7.77,24.35 7.77,26.09 7.75,26.12 U$1.P$44
  Bottom 0.127: v7.75,24.3 7.75,22.5 6.95,21.59 6.95,19.04 RHD_B.42
IN56  (via drill 0.15)
  Top 0.127: v7.37,25 v7.38,25 7.37,25.06 7.37,26.09 U$1.P$43
  Bottom 0.127: v7.37,25 7.35,25 7.35,22.75 6.42,21.74 6.43,18.54 RHD_B.41
IN57  (via drill 0.15)
  Top 0.127: v6.95,24.3 6.97,24.26 U$1.P$42 | 6.97,26.15 U$1.P$42 | U$1.P$42 7,26.12 U$1.P$42
  Bottom 0.127: v6.95,24.3 6.95,22.8 6,21.76 6,18.04 RHD_B.40
IN58  (via drill 0.15)
  Top 0.127: v6.58,25 6.58,25.2 6.58,26 | 6.58,26.02 6.58,26 | U$1.P$41 6.62,26.12 6.62,26 6.58,26
  Bottom 0.127: RHD_B.39 6.03,17.54 5.6,18 5.6,21.95 6.58,22.98 v6.58,25
IN59  (via drill 0.15)
  Top 0.127: v6.15,24.3 6.17,24.41 6.17,26.09 6.12,26.12 U$1.P$40
  Bottom 0.127: RHD_B.38 6.03,17.04 5.2,17.86 5.2,22.1 6.15,23.05 v6.15,24.3
IN60  (via drill 0.15)
  Top 0.127: v5.78,25 5.78,25.96 5.75,26 5.75,26.12 U$1.P$39 | v5.78,25 5.78,24.97 | 5.75,25 v5.78,25
  Bottom 0.127: RHD_B.37 6.03,16.54 4.8,17.74 4.8,22.3 5.78,23.23 v5.78,25
IN61  (via drill 0.15)
  Top 0.127: 5.38,25.89 5.38,25.88 | 5.38,25.88 5.38,24.38 | 5.38,24.38 5.38,24.34 | 5.38,24.38 v5.38,24.3 | 5.38,25.88 U$1.P$38
  Bottom 0.127: v5.38,24.3 5.38,23.38 4.35,22.4 4.35,17.71 6.03,16.04 RHD_B.36
IN62  (via drill 0.15)
  Top 0.127: v4.98,25 4.98,25.96 5,26 5,26.12 U$1.P$37
  Bottom 0.127: RHD_B.35 6.03,15.54 3.8,17.79 3.8,22.5 4.98,23.58 v4.98,25
IN63  (via drill 0.15)
  Top 0.127: 4.58,26.02 4.58,26 | 4.58,26 4.58,24.38 | 4.58,24.38 v4.58,24.3 | v4.58,24.3 | 4.58,24.38 4.62,24.38 v4.58,24.3 | 4.58,26 4.62,26 4.62,26.12 U$1.P$36
  Bottom 0.127: RHD_B.34 6.03,15.04 3.35,17.71 3.35,22.5 4.58,23.6 v4.58,24.3
LEDOUT1
  Top 0.254: R4.2 19.18,0.8 PWR.C
LEDOUT2
  Top 0.254: R5.2 18.16,4.92 PLT.C
MIS02-  (via drill 0.25)
  Top 0.127: OUT.9 13.76,4.52 13.49,4.25 9.59,4.25 9.14,4.7 9.14,5.46 v8.13,6.48
  Bottom 0.127: 9.78,11.69 9.78,11.11 8.51,9.84 8.26,9.84 7.87,9.46 7.87,6.73 v8.13,6.48
  Bottom 0.152: RHD_B.24 9.78,11.69
MISO1+
  Top 0.127: OUT.8 13.26,6.24 13.68,6.67 13.68,8.79 13.08,9.4 13.08,10.86 12.82,11.11 RHD_A.25
  Top 0.152: RHD_A.25
MISO1-
  Top 0.127: OUT.7 12.76,6.25 13.34,6.83 13.34,8.51 12.57,9.27 12.57,10.86 12.32,11.11 RHD_A.24
  Top 0.152: 12.32,11.73 RHD_A.24
MISO2+  (via drill 0.25)
  Top 0.127: OUT.10 14.26,4.38 13.75,3.87 8.98,3.87 7.78,5.08 v7.78,5.33
  Bottom 0.127: 9.27,11.68 9.27,11.11 8.38,10.22 8.13,10.22 7.49,9.59 7.49,5.62 v7.78,5.33
  Bottom 0.152: RHD_B.25 9.27,11.68
MOSI+  (via drill 0.25)
  Top 0.127: 12.22,5.52 12.22,6.54 12.35,6.67 12.73,6.67 12.92,6.86 12.92,7.94 12.52,8.34 | v12.03,12.6 11.82,12.39 RHD_A.23 11.82,11.1 12.06,10.86 12.06,8.5
  Top 0.152: OUT.6 12.22,5.52 | 12.52,8.34 R3.2 12.06,8.5
  Top 0.2: 11.82,12.39 12.1,12.39 12.1,13.15 10.1,13.15 v10.1,12.6
  Bottom 0.127: RHD_B.23 10.32,12.37 v10.1,12.6 10.1,12.7
MOSI-  (via drill 0.25)
  Top 0.127: 11.72,5.53 11.72,6.77 R3.1 | 12.19,7.28 11.56,7.91 11.56,10.86 11.32,11.09 RHD_A.22 11.32,12.46 v11.08,12.6 11.3,12.48
  Top 0.152: OUT.5 11.72,5.53 | 12.19,7.28 R3.1
  Bottom 0.127: RHD_B.22 10.83,12.26 10.83,12.48 v11.08,12.6
N$3
  Bottom 0.254: RHD_B.28 6.38,11.74 6.38,11.67 C8.1
N$7
  Top 0.254: RHD_A.28 15.72,11.74 arc-90 C5.1
REF  (via drill 0.15, 0.25, 1.3)
  Top 0.127: U$1.P$68 17.38,24.32 v17.38,24.3 | U$1.P$3 5.37,22.72 2.85,21.25 2.85,16.48 v2.62,16.26
  Top 0.254: 5.52,14.99 5.97,14.54 RHD_A.10 7.87,14.54 7.87,18.99 14.22,18.99 14.22,14.67 v14.1,14.54 | 5.52,14.99 2.83,16.14 2.87,15.98 v2.62,16.26 | R6.2 5.23,14.69 5.52,14.99
  Bottom 0.127: v17.38,24.3 17.38,23.52 19.1,19.75 19.1,17.45 16.2,14.55 15.14,14.55 RHD_B.10
  Bottom 0.254: v14.1,14.54 14.23,14.54 RHD_B.10
SCLK+  (via drill 0.25)
  Top 0.127: 11.21,5.54 11.21,8 10.87,8.34 10.87,10.82 v10.83,10.79 RHD_A.21
  Top 0.152: OUT.4 11.21,5.54 11.21,5.52 | 10.42,8.34 R2.2 10.87,8.34
  Bottom 0.127: 11.34,11.68 11.34,11.16 10.97,10.79 v10.83,10.79
  Bottom 0.152: 11.32,11.73 RHD_B.21 11.3,11.71 11.34,11.68
SCLK-  (via drill 0.25)
  Top 0.127: 10.7,5.55 10.7,7.28 | 10.54,7.28 9.94,7.87 9.94,10.16 v10,10.22 10,10.83 10.29,11.11 10.29,11.74
  Top 0.152: OUT.3 10.7,5.55 | R2.1 10.32,7.3 10.32,7.43 | 10.7,7.28 R2.1 | 10.54,7.28 R2.1 | 10.29,11.74 RHD_A.20
  Bottom 0.127: 11.86,11.7 11.86,11 11.08,10.22 v10,10.22
  Bottom 0.152: RHD_B.20 11.86,11.7
VDD  (via drill 0.25)
  Top 0.127: v9.02,2.29 8.88,2.25 7.12,2.25 7.12,0.88 6.75,0.5 2.12,0.5 2.12,4.38 2.38,4.62 2.38,6.88 2.25,7 2.25,7.88 2.38,8 3.25,8 U1.VS2 | v4.06,9.65 4.12,9.75 4.62,10.25 4.62,11.5 5.38,12.25 C6.2
  Top 0.152: 9.65,1.4 9.73,1.4 OUT.20
  Top 0.254: RHD_A.26 13.32,12.7 13.9,12.7 v13.97,12.76 14.24,13.04 RHD_B.13 RHD_A.31 15.12,13.53 | v17.14,7.3 18.41,7.3 PLATE.1 | U1.VS2 U1.VS1 C1.1 3.96,9.55 v4.06,9.65 | v8.13,12.76 7.86,13.04 RHD_B.30 6.39,13.04 5.71,12.36 C6.2 | v21.59,2.35 21.59,1.49 PWR.A | C7.2 16.99,8.87 v17.08,8.95
  Top 0.406: v9.02,2.29 9.4,2.29 9.65,2.03 9.65,1.4
  Bottom 0.127: RHD_B.26 8.82,12.93 | C9.2 16.75,12 17.62,12 17.62,9.5 17.12,9 v17.08,8.95 17,8.88 17,7.38 17.12,7.38 v17.14,7.3 17.25,7.25 17.25,6.62 21.5,2.38 v21.59,2.35
  Bottom 0.152: RHD_B.13 14.86,13.04
  Bottom 0.2: RHD_B.26 8.85,11.74 8.85,13.15 13.97,13.15 v13.97,12.76
  Bottom 0.254: C9.2 16.64,12.76 16.36,13.04 RHD_B.13 14.24,13.04 v13.97,12.76 | RHD_B.31 RHD_B.30 7.86,13.04 v8.13,12.76 8.82,12.76 RHD_B.26
VESD  (via drill 0.15, 0.25)
  Top 0.152: v18.03,14.03 v18.03,14.04 v18.03,14.03
  Top 0.254: RHD_A.32 v18.03,14.04 | v18.03,14.03 22.23,14.03 22.23,9.59 | 22.23,9.59 19.05,9.59 PLATE.2 | PLT.A 22.23,3.62 22.23,9.59 | v4.06,14.41 2.13,14.41 0.8,15.75 0.8,17 2.15,18.75 v2.15,23.65
  Bottom 0.254: RHD_B.32 6.09,14.04 5.97,14.16 4.06,14.16 v4.06,14.41 | v2.15,23.65 2.15,25.55 3.05,26.75 18.7,26.75 19.55,25.5 19.55,17.15 19.2,16.82 18.03,15.65 v18.03,14.03
XOUT1
  Top 0.127: 6.73,12.51 6.73,8.74 6.29,8.29 C2.2 5.59,7.59 5.33,7.34 U1.XOUT
  Top 0.152: RHD_A.14 6.76,12.54 6.73,12.51
YOUT1
  Top 0.127: RHD_A.15 7.11,11.02 7.11,8 5.97,6.86 5.97,5.37 | 5.97,5.37 5.97,3.39 C3.2 | U1.YOUT 5.97,5.37
ZOUT1
  Top 0.127: RHD_A.16 8.32,11.31 7.49,10.48 7.49,7.75 6.73,6.99 6.73,2.03 6.16,1.46 5.14,1.46 4.51,2.1 4.51,2.73 | U1.ZOUT 4.51,2.73 | C4.2 4.51,2.73

### Text on the board
tPlace: REF | GND
bPlace: 2X32_JMD / Headstage Rev. 0 / CC BY-SA JPN 2014 / open-ephys.org